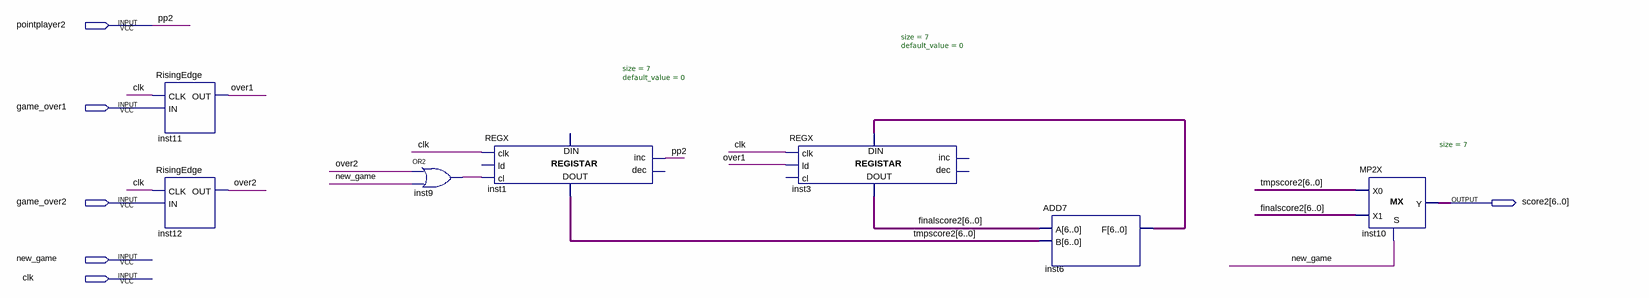
[diagram p0: schematic sheet]
// Quartus schematic score2.bdf as structural Verilog: 7 symbols, 6 pins
module score2 (
  input  pointplayer2,
  input  game_over1,
  input  game_over2,
  input  new_game,
  input  clk,
  output [6:0] score2
);

  wire inst9_out, over1, over2;
  wire [6:0] finalscore2, inst6_f, tmpscore2;

  RisingEdge inst11 (.CLK(clk), .IN(game_over1), .OUT(over1));
  RisingEdge inst12 (.CLK(clk), .IN(game_over2), .OUT(over2));
  or inst9 (inst9_out, over2, new_game);
  REGX #(.size(7), .default_value(0)) inst1 (
    .clk(clk), .cl(inst9_out), .inc(pointplayer2), .data_out(tmpscore2));  // open: ld, dec, data_in
  REGX #(.size(7), .default_value(0)) inst3 (
    .clk(clk), .ld(over1), .data_in(inst6_f), .data_out(finalscore2));  // open: cl, inc, dec
  ADD7 inst6 (.A(finalscore2), .B(tmpscore2), .F(inst6_f));
  MP2X #(.size(7)) inst10 (.S(new_game), .X0(tmpscore2), .X1(finalscore2), .Y(score2));

  // Other names for the same wires on the sheet: pp2 = pointplayer2
endmodule
